# EAGLE design untitled (EAGLE 9.6.0)
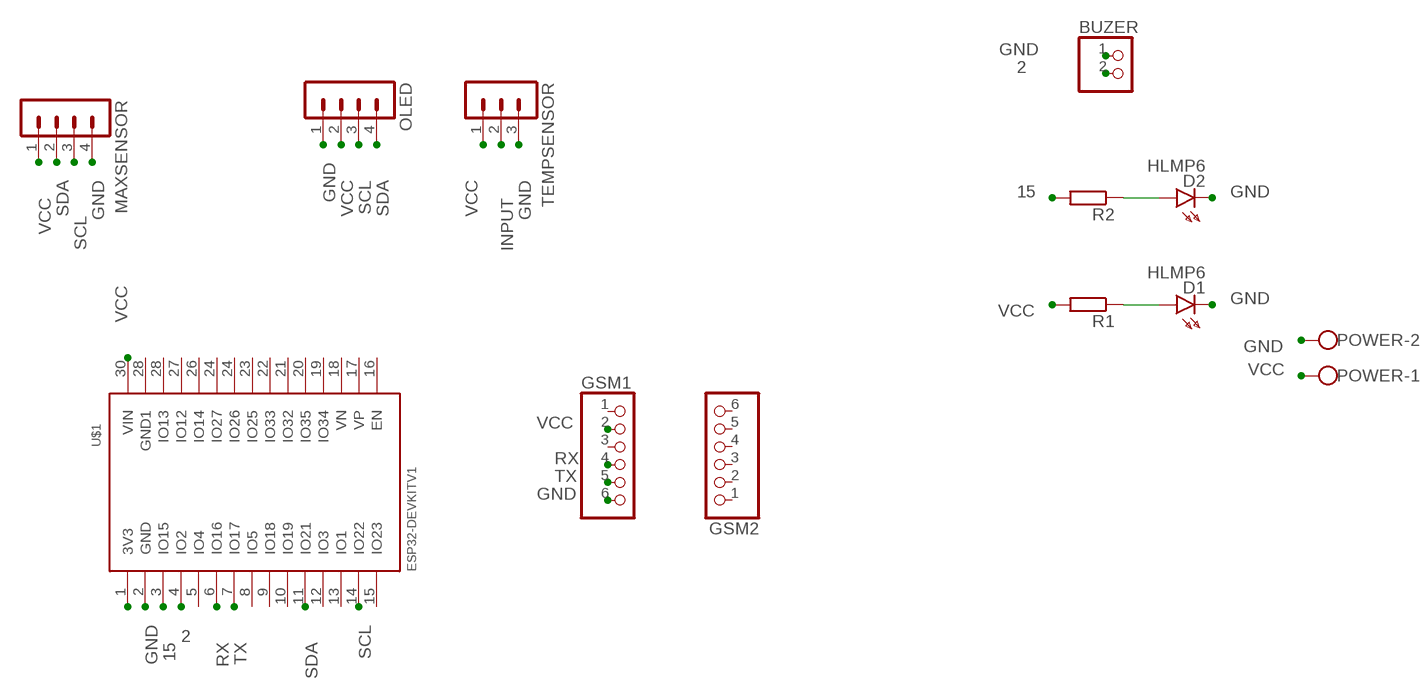
[diagram p0: schematic, sheet 1]

## Parts
BUZER  PINHD-1X2  [1X02]
D1  HLMP6  [HLMP6]
D2  HLMP6  [HLMP6]
GSM1  PINHD-1X6  [1X06]
GSM2  PINHD-1X6  [1X06]
MAXSENSOR  MA04-1  [MA04-1]
OLED  MA04-1  [MA04-1]
POWER  W237-102  [W237-102]
R1  R-EU_0204/5  [0204/5]
R2  R-EU_0204/5  [0204/5]
TEMPSENSOR  MA03-1  [MA03-1]
U$1  ESP32DEVKITV1  [ESP32-DEVKITV1]

## Nets
2: BUZER.2 U$1.4(IO2)
15: R2.2 U$1.3(IO15)
GND: BUZER.1 D1.K D2.K GSM1.6 MAXSENSOR.4 OLED.1 POWER.2 TEMPSENSOR.3 U$1.2(GND)
INPUT: TEMPSENSOR.2
N$1: D2.A R2.1
N$2: D1.A R1.1
N$7: U$1.1(3V3)
RX: GSM1.4 U$1.6(IO16)
SCL: MAXSENSOR.3 OLED.3 U$1.14(IO22)
SDA: MAXSENSOR.2 OLED.4 U$1.11(IO21)
TX: GSM1.5 U$1.7(IO17)
VCC: GSM1.2 MAXSENSOR.1 OLED.2 POWER.1 R1.2 TEMPSENSOR.1 U$1.30(VIN)
Unconnected: GSM1.1 GSM1.3 GSM2.1 GSM2.2 GSM2.3 GSM2.4 GSM2.5 GSM2.6 U$1.5(IO4) U$1.8(IO5) U$1.9(IO18) U$1.10(IO19) U$1.12(IO3) U$1.13(IO1) U$1.15(IO23) U$1.16(EN) U$1.17(VP) U$1.18(VN) U$1.19(IO34) U$1.20(IO35) U$1.21(IO32) U$1.22(IO33) U$1.23(IO25) U$1.24(IO26) U$1.24(IO27) U$1.26(IO14) U$1.27(IO12) U$1.28(GND1) U$1.28(IO13)

## Library data of the parts
BUZER = pinhead:PINHD-1X2: PIN HEADER
D1 D2 = display-hp:HLMP6: LED 2mm horizontal; MF: AGILENT TECHNOLOGIES; MPN: HLMP-6500; OC_FARNELL: 1652490; OC_NEWARK: 40K0088
GSM1 GSM2 = adafruit:PINHD-1X6: PIN HEADER
MAXSENSOR OLED = con-lstb:MA04-1: PIN HEADER; OC_FARNELL: unknown; OC_NEWARK: unknown
POWER = con-wago-500:W237-102: WAGO SCREW CLAMP; MPN: 237-102; OC_FARNELL: unknown; OC_NEWARK: 70K9898
R1 R2 = resistor abdallah:R-EU_: RESISTOR, European symbol; SPICEPREFIX: R
TEMPSENSOR = con-lstb:MA03-1: PIN HEADER; OC_FARNELL: unknown; OC_NEWARK: unknown
U$1 = ESP_ABDALLH:ESP32DEVKITV1

## Net classes
0 default: width 1 mm

## Board
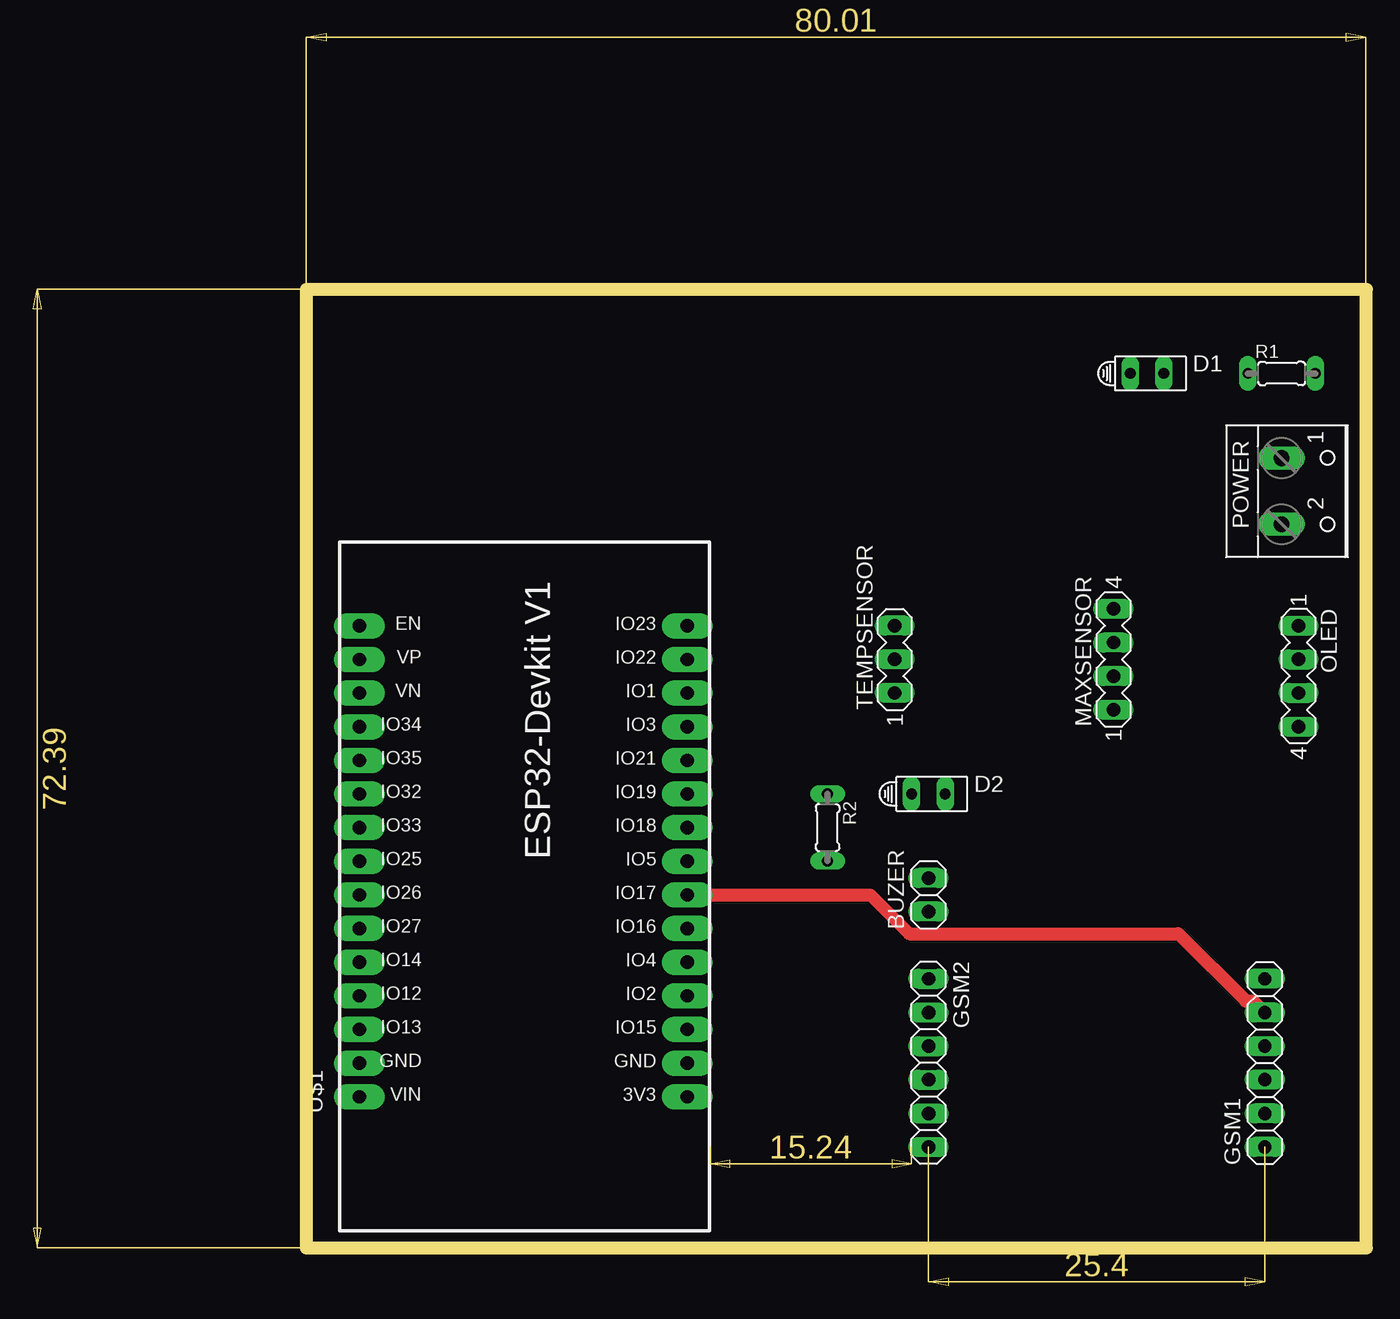
[diagram p1: board, top side]
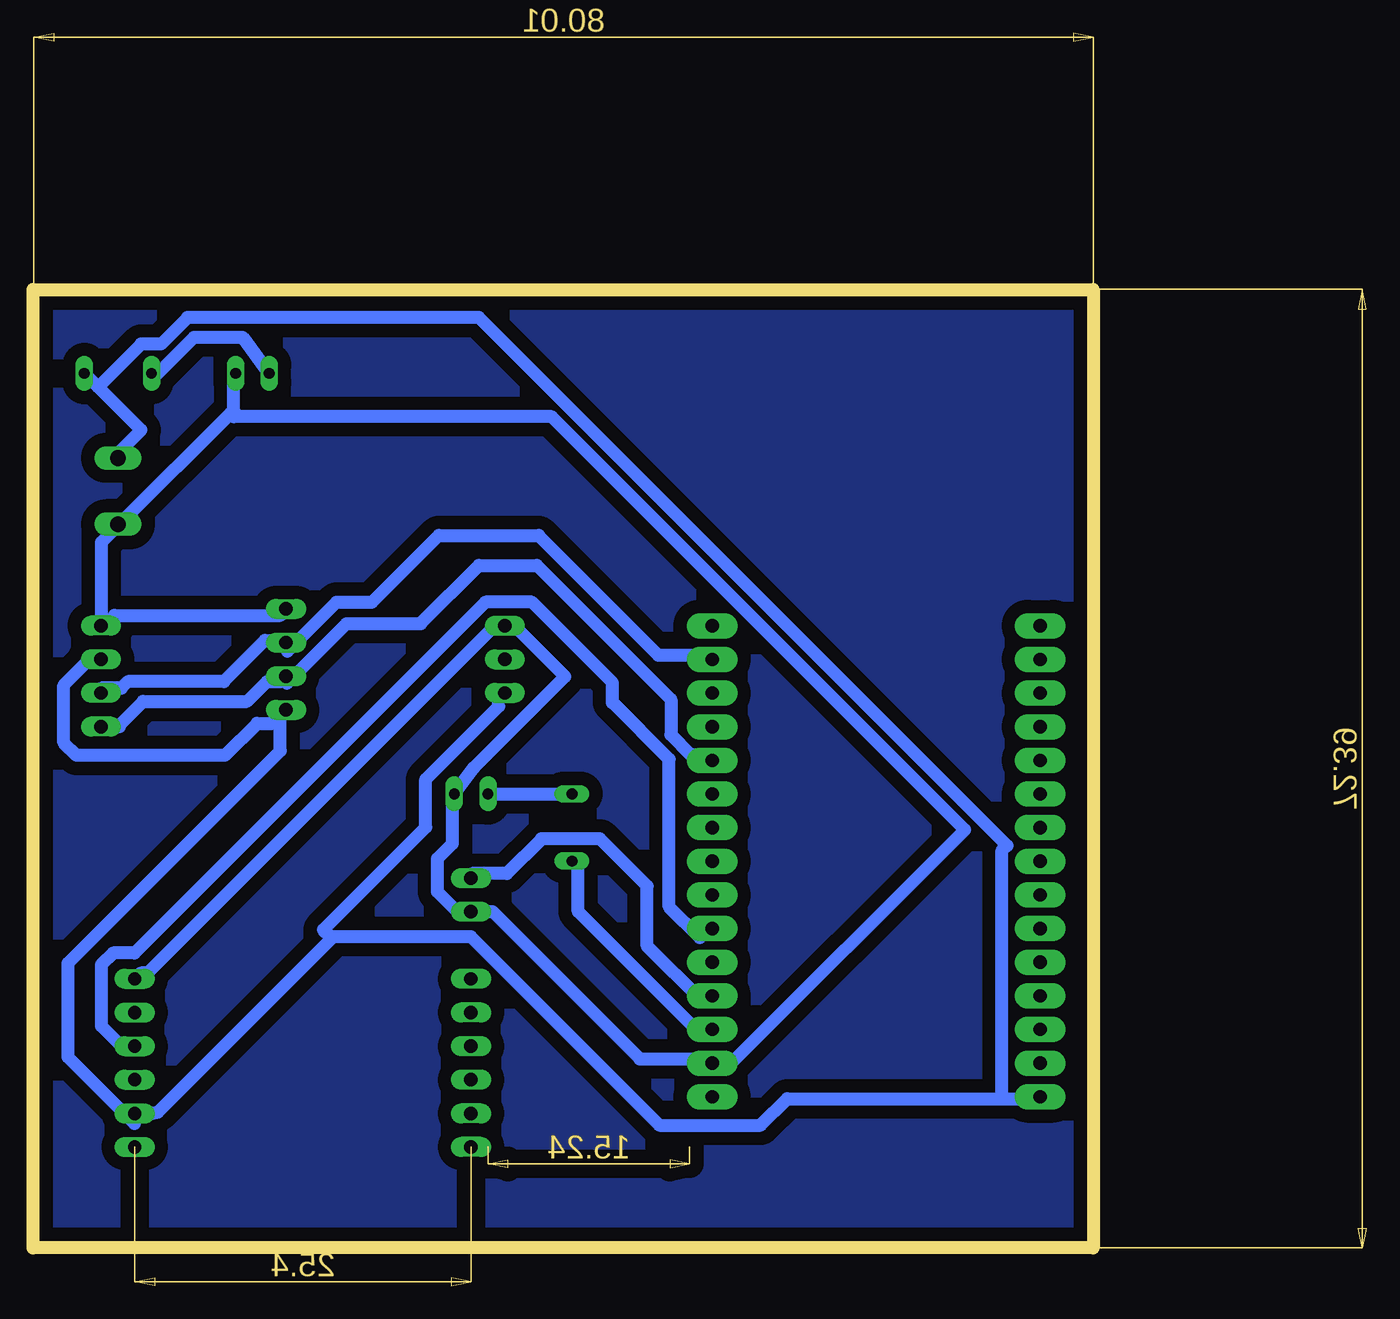
[diagram p2: board, bottom side, seen from below]

Size 80.06 x 72.38 mm. Coordinates in mm from the lower left corner, seen from the top.
Outline: 0,0 80.06,0 80.06,72.38 0,72.38 0,0
Copper layers (1*16): Top 0.035mm / dielectric 1.5mm / Bottom 0.035mm
Design rules "default *": minimum track width 6mil, minimum drill 0.35mm, track to track 16mil, track to pad 16mil, pad to pad 16mil, via to via 16mil, smd to smd 16mil, copper to edge 40mil, drill to drill 6mil, minimum pad ring 10mil, minimum via ring 8mil, stop-mask expansion 4mil, vias tented up to drill 0mil, thermal gap 10mil

### Footprints (pad centres in the part's own frame; a part is rotated, then mirrored left to right if it is on the bottom)
1X02 = drill 1.016 long: 1 -1.27,0; 2 1.27,0
HLMP6 = drill 0.813 long: A -1.27,0; K 1.27,0
1X06 = drill 1.016 long: 1 -6.35,0; 2 -3.81,0; 3 -1.27,0; 4 1.27,0; 5 3.81,0; 6 6.35,0
MA04-1 = drill 1.016 long: 1 -3.81,0; 2 -1.27,0; 3 1.27,0; 4 3.81,0
W237-102 = drill 1.194 long: 1 -2.5,-1.27; 2 2.5,-1.27
0204/5 = drill 0.813 long: 1 -2.54,0; 2 2.54,0
MA03-1 = drill 1.016 long: 1 -2.54,0; 2 0,0; 3 2.54,0
ESP32-DEVKITV1 = drill 1 pad 1.93 long: 1 -22.87,-13.54; 2 -20.33,-13.54; 3 -17.79,-13.54; 4 -15.25,-13.54; 5 -12.71,-13.54; 6 -10.17,-13.54; 7 -7.63,-13.54; 8 -5.09,-13.54; 9 -2.55,-13.54; 10 -0.01,-13.54; 11 2.53,-13.54; 12 5.07,-13.54; 13 7.61,-13.54; 14 10.15,-13.54; 15 12.69,-13.54; 16 12.69,11.23; 17 10.15,11.23; 18 7.61,11.23; 19 5.07,11.23; 20 2.53,11.23; 21 -0.01,11.23; 22 -2.55,11.23; 23 -5.09,11.23; 24 -7.63,11.23; 25 -10.17,11.23; 26 -12.71,11.23; 27 -15.25,11.23; 28 -17.79,11.23; 29 -20.33,11.23; 30 -22.87,11.23

### Placement (x,y rotation side)
BUZER  46.99,26.67 90 top
D1  63.5,66.04 0 top
D2  46.99,34.29 0 top
GSM1  72.39,13.97 90 top
GSM2  46.99,13.97 270 top
MAXSENSOR  60.96,44.45 90 top
OLED  74.93,43.18 270 top
POWER  74.93,57.15 270 top
R1  73.66,66.04 0 top
R2  39.37,31.75 270 top
TEMPSENSOR  44.45,44.45 90 top
U$1  15.24,34.29 90 top

### Tracks (layer width: path | path; a pad name or v marks a point on that pad's centre or on a via)
2
  Bottom 1: BUZER.2 46.9,28.27 44.3,28.27 41.67,30.9 37.26,30.9 33.69,27.33 33.69,22.8 29.53,18.64 28.9,19.27 U$1.4
15
  Bottom 1: U$1.3 29.56,16.5 29.78,16.28 38.9,25.4 38.9,28.77 R2.2
GND
  Bottom 1: 65.15,63.02 73.4,54.77 POWER.2 73.9,54.27 74.9,53.27 74.9,47.27 OLED.1 74.4,47.27 73.9,47.77 61.4,47.77 MAXSENSOR.4 | 65.15,63.02 64.9,63.27 64.9,65.77 D1.K | GSM1.6 71.9,20.77 71.41,20.77 45.15,47.02 45.14,46.99 TEMPSENSOR.3 43.74,46.99 39.9,43.15 46.76,36.29 D2.K 48.4,34.27 48.4,30.53 49.53,29.41 49.53,26.89 47.79,25.15 BUZER.1 45.38,25.4 34.25,14.27 28.9,14.27 U$1.2 28.45,13.63 27.66,13.63 9.71,31.58 40.9,62.77 64.9,62.77 65.15,63.02
N$1
  Bottom 1: R2.1 39.4,34.27 45.4,34.27 D2.A
N$2
  Bottom 1: D1.A 64.25,68.77 67.9,68.77 70.9,65.77 R1.1
N$3
  pour Bottom (isolate 1): 1.27,72.39 80.01,72.39 80.01,0 0,0 0,2.54 0,72.39
RX
  Bottom 1: GSM1.4 73.37,15.24 74.9,16.77 74.9,21.41 74.03,22.28 72.39,22.28 45.9,48.77 42.38,48.77 36.31,42.7 36.31,41.18 32.04,36.91 32.04,25.77 29.72,23.45 28.9,24.27 U$1.6
SCL
  Bottom 1: OLED.3 74.9,42.27 73.4,42.27 72.9,42.77 65.67,42.77 62.54,45.9 MAXSENSOR.3 60.87,45.05 57.15,48.77 54.47,48.77 49.44,53.8 41.89,53.8 32.86,44.77 28.9,44.77 U$1.14
SDA
  Bottom 1: OLED.4 73.53,39.37 73.6,39.44 71.76,41.27 63.9,41.27 62.4,42.77 61.4,42.77 MAXSENSOR.2 60.88,42.66 56.4,47.14 50.8,47.14 46.4,51.54 42.01,51.54 31.89,41.42 31.89,38.76 30.4,37.27 28.9,37.27 U$1.11
TX
  Top 1: GSM1.5 71.52,18.65 70.94,18.65 65.86,23.73 45.54,23.73 42.61,26.66 U$1.7
VCC
  Bottom 1: 75.15,65.02 71.9,61.77 73.9,59.77 POWER.1 | 75.15,65.02 75.9,65.77 R1.2 | 57.38,23.52 70.63,10.27 71.12,10.16 GSM1.2 72.41,9.4 77.42,14.4 77.42,21.52 61.4,37.54 61.4,40.27 MAXSENSOR.1 61.98,39.62 63.15,39.62 65.59,37.19 76.79,37.19 77.74,38.15 77.74,42.5 75.93,44.31 75.07,44.31 OLED.2 | TEMPSENSOR.1 44.9,41.77 44.9,40.91 50.41,35.4 50.41,31.76 58.15,24.02 57.65,23.52 57.38,23.52 | 6.9,11.27 23.11,11.27 25.12,9.26 32.76,9.26 47.02,23.52 57.38,23.52 | 6.9,11.27 4.4,11.27 U$1.30 | 75.15,65.02 71.9,68.27 70.4,68.27 68.4,70.27 46.4,70.27 6.53,30.4 6.9,30.02 6.9,11.27